# Altium project camera_board.PrjPcb
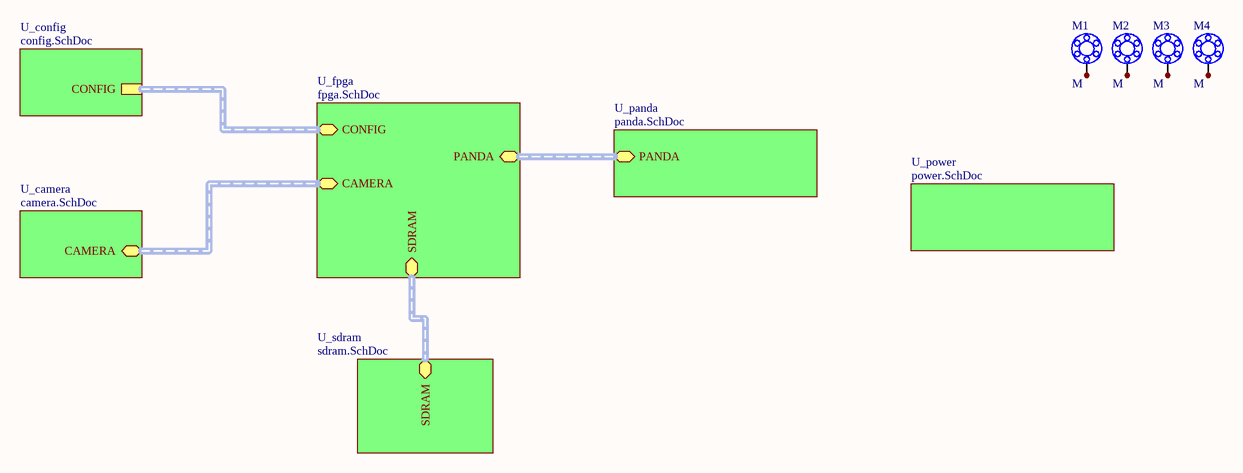
[diagram p0: main.SchDoc]
7 sheets, 119 parts. Net scope: hierarchical (ports join the sheet entries above them; power ports are global).
Board file: camera_board.PcbDoc
Sheets:
  main.SchDoc
    U_fpga = fpga.SchDoc
    U_power = power.SchDoc
    U_config = config.SchDoc
    U_panda = panda.SchDoc
    U_camera = camera.SchDoc
    U_sdram = sdram.SchDoc

## Sheet main.SchDoc
size A4

### Parts
M1  M  [MOUNTING]  (no BOM)
M2  M  [MOUNTING]  (no BOM)
M3  M  [MOUNTING]  (no BOM)
M4  M  [MOUNTING]  (no BOM)

### Sub-sheets
U_camera = camera.SchDoc: CAMERA (harness CAMERA)
U_config = config.SchDoc: CONFIG (harness CONFIG)
U_fpga = fpga.SchDoc: CONFIG (harness CONFIG), CAMERA (harness CAMERA), SDRAM (harness SDRAM), PANDA (harness PANDA)
U_panda = panda.SchDoc: PANDA (harness PANDA)
U_power = power.SchDoc: no entries
U_sdram = sdram.SchDoc: SDRAM (harness SDRAM)

### Nets
NetM1_1: M1.1 M1.2 M1.3 M1.4 M1.5 M1.6 M1.7
NetM2_1: M2.1 M2.2 M2.3 M2.4 M2.5 M2.6 M2.7
NetM3_1: M3.1 M3.2 M3.3 M3.4 M3.5 M3.6 M3.7
NetM4_1: M4.1 M4.2 M4.3 M4.4 M4.5 M4.6 M4.7

### Buses and harness runs
harness sheet U_camera/CAMERA = sheet U_fpga/CAMERA
harness sheet U_config/CONFIG = sheet U_fpga/CONFIG
harness sheet U_fpga/PANDA = sheet U_panda/PANDA
harness sheet U_fpga/SDRAM = sheet U_sdram/SDRAM

### Library data of the parts
M1-M4 = MOUNTING: MOUNTING HOLE - NON INSTALLABLE

## Sheet fpga.SchDoc
size A2
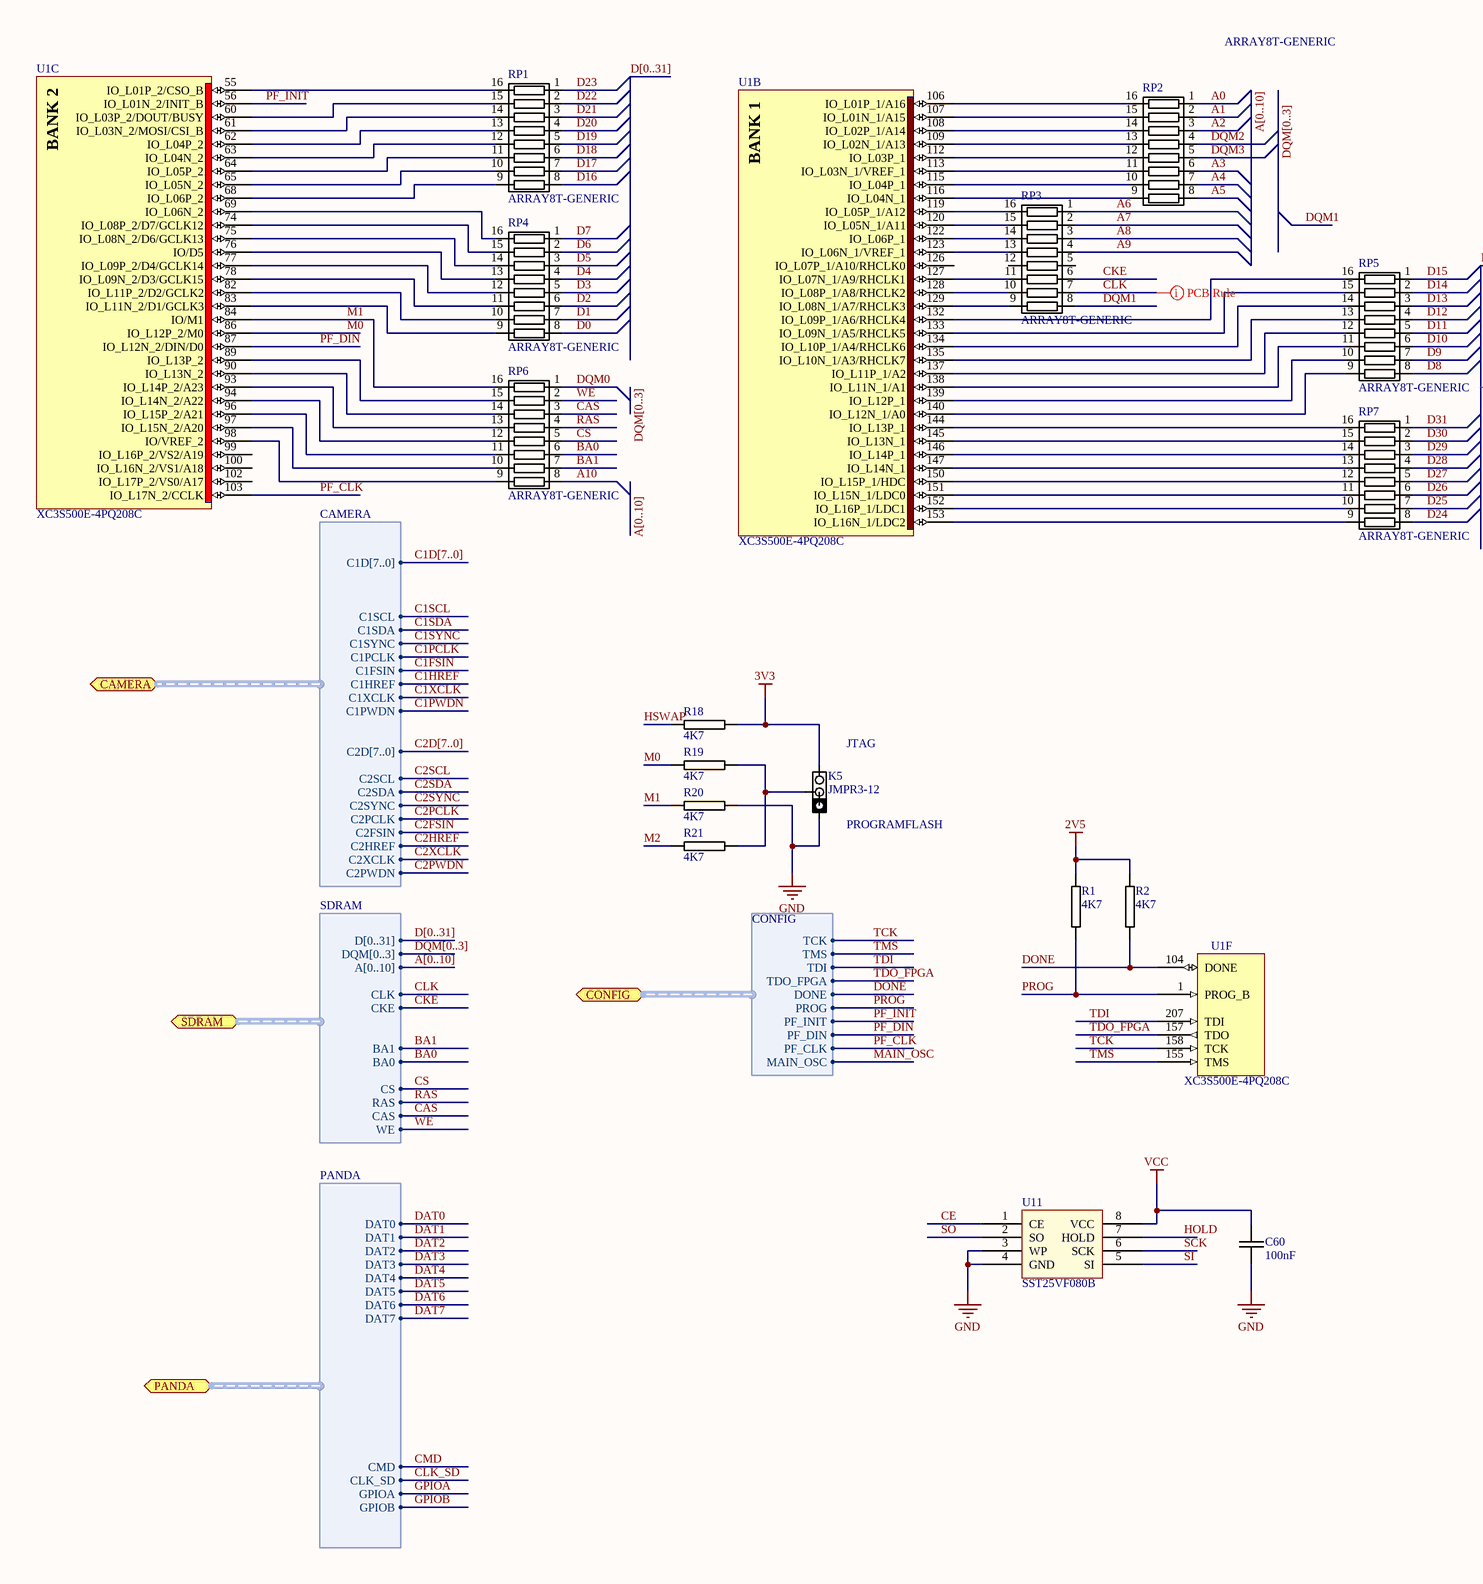
[diagram p1: fpga.SchDoc, left]
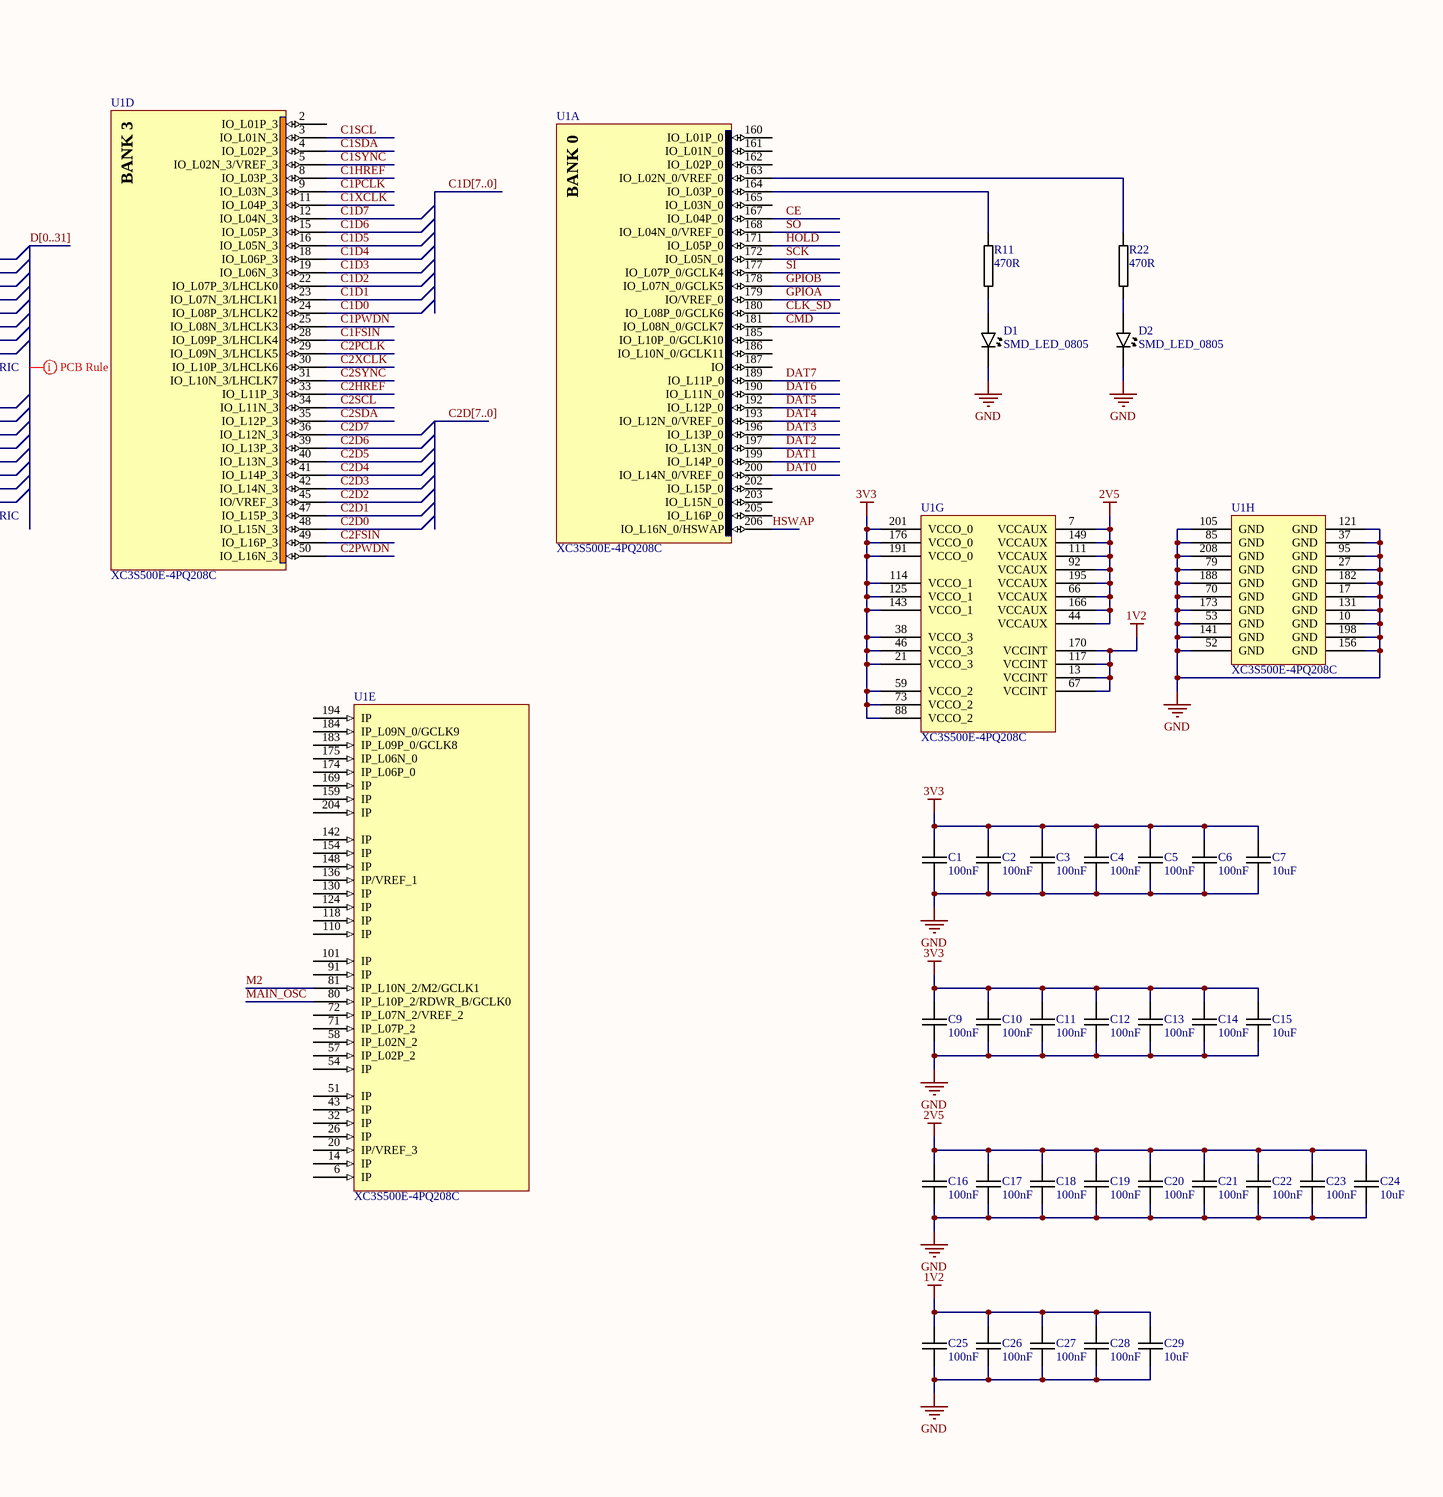
[diagram p2: fpga.SchDoc, right]

### Parts
C1  100nF  [0603C-GENERIC]
C2  100nF  [0603C-GENERIC]
C3  100nF  [0603C-GENERIC]
C4  100nF  [0603C-GENERIC]
C5  100nF  [0603C-GENERIC]
C6  100nF  [0603C-GENERIC]
C7  10uF  [0805C-GENERIC]
C9  100nF  [0603C-GENERIC]
C10  100nF  [0603C-GENERIC]
C11  100nF  [0603C-GENERIC]
C12  100nF  [0603C-GENERIC]
C13  100nF  [0603C-GENERIC]
C14  100nF  [0603C-GENERIC]
C15  10uF  [0805C-GENERIC]
C16  100nF  [0603C-GENERIC]
C17  100nF  [0603C-GENERIC]
C18  100nF  [0603C-GENERIC]
C19  100nF  [0603C-GENERIC]
C20  100nF  [0603C-GENERIC]
C21  100nF  [0603C-GENERIC]
C22  100nF  [0603C-GENERIC]
C23  100nF  [0603C-GENERIC]
C24  10uF  [0805C-GENERIC]
C25  100nF  [0603C-GENERIC]
C26  100nF  [0603C-GENERIC]
C27  100nF  [0603C-GENERIC]
C28  100nF  [0603C-GENERIC]
C29  10uF  [0805C-GENERIC]
C60  100nF  [0603C-GENERIC]
D1  SMD_LED_0805  [CD2012-0805]
D2  SMD_LED_0805  [CD2012-0805]
K5  JMPR3-12  [JMPR3-CLOSED-12]
R1  4K7  [0603R-4K7]
R2  4K7  [0603R-4K7]
R11  470R  [0603R-470]
R18  4K7  [0603R-4K7]
R19  4K7  [0603R-4K7]
R20  4K7  [0603R-4K7]
R21  4K7  [0603R-4K7]
R22  470R  [0603R-470]
RP1  ARRAY8T-GENERIC  [1206-ARRAY-8-GENERIC]
RP2  ARRAY8T-GENERIC  [1206-ARRAY-8-GENERIC]
RP3  ARRAY8T-GENERIC  [1206-ARRAY-8-GENERIC]
RP4  ARRAY8T-GENERIC  [1206-ARRAY-8-GENERIC]
RP5  ARRAY8T-GENERIC  [1206-ARRAY-8-GENERIC]
RP6  ARRAY8T-GENERIC  [1206-ARRAY-8-GENERIC]
RP7  ARRAY8T-GENERIC  [1206-ARRAY-8-GENERIC]
U1  XC3S500E-4PQ208C  [PQ208_N]  (parts A,B,C,D,E,F,G,H of 8)
U11  SST25VF080B  [SOIC127P600-8BM]

### Ports
CAMERA (harness CAMERA), CONFIG (harness CONFIG), PANDA (harness PANDA), SDRAM (harness SDRAM)

### Harnesses
CONFIG: TCK, TMS, TDI, TDO_FPGA, DONE, PROG, PF_DIN, PF_INIT, PF_CLK, MAIN_OSC
CAMERA: C1D[7..0], C1SCL, C1SDA, C1SYNC, C1PCLK, C1FSIN, C1HREF, C1XCLK, C1PWDN, C2D[7..0], C2SCL, C2SDA, C2SYNC, C2PCLK, C2HREF, C2FSIN, C2XCLK, C2PWDN
SDRAM: D[0..31], DQM[0..3], A[0..10], CLK, CKE, BA1, BA0, CS, RAS, CAS, WE
PANDA: DAT0, DAT1, DAT2, DAT3, DAT4, DAT5, DAT6, DAT7, CMD, CLK_SD, GPIOA, GPIOB

### Nets
1V2: C25.1 C26.1 C27.1 C28.1 C29.1 U1.13(VCCINT) U1.67(VCCINT) U1.117(VCCINT) U1.170(VCCINT)
2V5: C16.1 C17.1 C18.1 C19.1 C20.1 C21.1 C22.1 C23.1 C24.1 R1.1 R2.1 U1.7(VCCAUX) U1.44(VCCAUX) U1.66(VCCAUX) U1.92(VCCAUX) U1.111(VCCAUX) U1.149(VCCAUX) U1.166(VCCAUX) U1.195(VCCAUX)
3V3: C1.1 C2.1 C3.1 C4.1 C5.1 C6.1 C7.1 C9.1 C10.1 C11.1 C12.1 C13.1 C14.1 C15.1 K5.3 R18.2 U1.21(VCCO_3) U1.38(VCCO_3) U1.46(VCCO_3) U1.59(VCCO_2) U1.73(VCCO_2) U1.88(VCCO_2) U1.114(VCCO_1) U1.125(VCCO_1) U1.143(VCCO_1) U1.176(VCCO_0) U1.191(VCCO_0) U1.201(VCCO_0)
GND: C1.2 C2.2 C3.2 C4.2 C5.2 C6.2 C7.2 C9.2 C10.2 C11.2 C12.2 C13.2 C14.2 C15.2 C16.2 C17.2 C18.2 C19.2 C20.2 C21.2 C22.2 C23.2 C24.2 C25.2 C26.2 C27.2 C28.2 C29.2 C60.2 D1.2(K) D2.2(K) K5.1 R20.2 U1.10(GND) U1.17(GND) U1.27(GND) U1.37(GND) U1.52(GND) U1.53(GND) U1.70(GND) U1.79(GND) U1.85(GND) U1.95(GND) U1.105(GND) U1.121(GND) U1.131(GND) U1.141(GND) U1.156(GND) U1.173(GND) U1.182(GND) U1.188(GND) U1.198(GND) U1.208(GND) U11.3(WP) U11.4(GND)
VCC: C60.1 U11.8(VCC)
A0: RP2.1
A1: RP2.2
A2: RP2.3
A3: RP2.6
A4: RP2.7
A5: RP2.8
A6: RP3.1
A7: RP3.2
A8: RP3.3
A9: RP3.4
A10: RP6.8
BA0: RP6.6 ; port SDRAM.BA0
BA1: RP6.7 ; port SDRAM.BA1
C1D0: U1.24(IO_L08P_3/LHCLK2)
C1D1: U1.23(IO_L07N_3/LHCLK1)
C1D2: U1.22(IO_L07P_3/LHCLK0)
C1D3: U1.19(IO_L06N_3)
C1D4: U1.18(IO_L06P_3)
C1D5: U1.16(IO_L05N_3)
C1D6: U1.15(IO_L05P_3)
C1D7: U1.12(IO_L04N_3)
C1FSIN: U1.28(IO_L09P_3/LHCLK4) ; port CAMERA.C1FSIN
C1HREF: U1.8(IO_L03P_3) ; port CAMERA.C1HREF
C1PCLK: U1.9(IO_L03N_3) ; port CAMERA.C1PCLK
C1PWDN: U1.25(IO_L08N_3/LHCLK3) ; port CAMERA.C1PWDN
C1SCL: U1.3(IO_L01N_3) ; port CAMERA.C1SCL
C1SDA: U1.4(IO_L02P_3) ; port CAMERA.C1SDA
C1SYNC: U1.5(IO_L02N_3/VREF_3) ; port CAMERA.C1SYNC
C1XCLK: U1.11(IO_L04P_3) ; port CAMERA.C1XCLK
C2D0: U1.48(IO_L15N_3)
C2D1: U1.47(IO_L15P_3)
C2D2: U1.45(IO/VREF_3)
C2D3: U1.42(IO_L14N_3)
C2D4: U1.41(IO_L14P_3)
C2D5: U1.40(IO_L13N_3)
C2D6: U1.39(IO_L13P_3)
C2D7: U1.36(IO_L12N_3)
C2FSIN: U1.49(IO_L16P_3) ; port CAMERA.C2FSIN
C2HREF: U1.33(IO_L11P_3) ; port CAMERA.C2HREF
C2PCLK: U1.29(IO_L09N_3/LHCLK5) ; port CAMERA.C2PCLK
C2PWDN: U1.50(IO_L16N_3) ; port CAMERA.C2PWDN
C2SCL: U1.34(IO_L11N_3) ; port CAMERA.C2SCL
C2SDA: U1.35(IO_L12P_3) ; port CAMERA.C2SDA
C2SYNC: U1.31(IO_L10N_3/LHCLK7) ; port CAMERA.C2SYNC
C2XCLK: U1.30(IO_L10P_3/LHCLK6) ; port CAMERA.C2XCLK
CAS: RP6.3 ; port SDRAM.CAS
CE: U1.167(IO_L04P_0) U11.1(CE)
CKE: RP3.6 ; port SDRAM.CKE
CLK: RP3.7 ; port SDRAM.CLK
CLK_SD: U1.180(IO_L08P_0/GCLK6) ; port PANDA.CLK_SD
CMD: U1.181(IO_L08N_0/GCLK7) ; port PANDA.CMD
CS: RP6.5 ; port SDRAM.CS
D0: RP4.8
D1: RP4.7
D2: RP4.6
D3: RP4.5
D4: RP4.4
D5: RP4.3
D6: RP4.2
D7: RP4.1
D8: RP5.8
D9: RP5.7
D10: RP5.6
D11: RP5.5
D12: RP5.4
D13: RP5.3
D14: RP5.2
D15: RP5.1
D16: RP1.8
D17: RP1.7
D18: RP1.6
D19: RP1.5
D20: RP1.4
D21: RP1.3
D22: RP1.2
D23: RP1.1
D24: RP7.8
D25: RP7.7
D26: RP7.6
D27: RP7.5
D28: RP7.4
D29: RP7.3
D30: RP7.2
D31: RP7.1
DAT0: U1.200(IO_L14N_0/VREF_0) ; port PANDA.DAT0
DAT1: U1.199(IO_L14P_0) ; port PANDA.DAT1
DAT2: U1.197(IO_L13N_0) ; port PANDA.DAT2
DAT3: U1.196(IO_L13P_0) ; port PANDA.DAT3
DAT4: U1.193(IO_L12N_0/VREF_0) ; port PANDA.DAT4
DAT5: U1.192(IO_L12P_0) ; port PANDA.DAT5
DAT6: U1.190(IO_L11N_0) ; port PANDA.DAT6
DAT7: U1.189(IO_L11P_0) ; port PANDA.DAT7
DONE: R2.2 U1.104(DONE) ; port CONFIG.DONE
DQM0: RP6.1
DQM1: RP3.8
DQM2: RP2.4
DQM3: RP2.5
GPIOA: U1.179(IO/VREF_0) ; port PANDA.GPIOA
GPIOB: U1.178(IO_L07N_0/GCLK5) ; port PANDA.GPIOB
HOLD: U1.171(IO_L05P_0) U11.7(HOLD)
HSWAP: R18.1 U1.206(IO_L16N_0/HSWAP)
M0: R19.1 U1.86(IO_L12P_2/M0)
M1: R20.1 RP6.16 U1.84(IO/M1)
M2: R21.1 U1.81(IP_L10N_2/M2/GCLK1)
MAIN_OSC: U1.80(IP_L10P_2/RDWR_B/GCLK0) ; port CONFIG.MAIN_OSC
PF_CLK: U1.103(IO_L17N_2/CCLK) ; port CONFIG.PF_CLK
PF_DIN: U1.87(IO_L12N_2/DIN/D0) ; port CONFIG.PF_DIN
PF_INIT: U1.56(IO_L01N_2/INIT_B) ; port CONFIG.PF_INIT
PROG: R1.2 U1.1(PROG_B) ; port CONFIG.PROG
RAS: RP6.4 ; port SDRAM.RAS
SCK: U1.172(IO_L05N_0) U11.6(SCK)
SI: U1.177(IO_L07P_0/GCLK4) U11.5(SI)
SO: U1.168(IO_L04N_0/VREF_0) U11.2(SO)
TCK: U1.158(TCK) ; port CONFIG.TCK
TDI: U1.207(TDI) ; port CONFIG.TDI
TDO_FPGA: U1.157(TDO) ; port CONFIG.TDO_FPGA
TMS: U1.155(TMS) ; port CONFIG.TMS
WE: RP6.2 ; port SDRAM.WE
NetD1_1: D1.1(A) R11.2
NetD2_1: D2.1(A) R22.2
NetK5_2: K5.2 R19.2 R21.2
NetR11_1: R11.1 U1.164(IO_L03P_0)
NetR22_1: R22.1 U1.163(IO_L02N_0/VREF_0)
NetRP1_9: RP1.9 U1.68(IO_L06P_2)
NetRP1_10: RP1.10 U1.65(IO_L05N_2)
NetRP1_11: RP1.11 U1.64(IO_L05P_2)
NetRP1_12: RP1.12 U1.63(IO_L04N_2)
NetRP1_13: RP1.13 U1.62(IO_L04P_2)
NetRP1_14: RP1.14 U1.61(IO_L03N_2/MOSI/CSI_B)
NetRP1_15: RP1.15 U1.60(IO_L03P_2/DOUT/BUSY)
NetRP1_16: RP1.16 U1.55(IO_L01P_2/CSO_B)
NetRP2_9: RP2.9 U1.116(IO_L04N_1)
NetRP2_10: RP2.10 U1.115(IO_L04P_1)
NetRP2_11: RP2.11 U1.113(IO_L03N_1/VREF_1)
NetRP2_12: RP2.12 U1.112(IO_L03P_1)
NetRP2_13: RP2.13 U1.109(IO_L02N_1/A13)
NetRP2_14: RP2.14 U1.108(IO_L02P_1/A14)
NetRP2_15: RP2.15 U1.107(IO_L01N_1/A15)
NetRP2_16: RP2.16 U1.106(IO_L01P_1/A16)
NetRP3_9: RP3.9 U1.129(IO_L08N_1/A7/RHCLK3)
NetRP3_10: RP3.10 U1.128(IO_L08P_1/A8/RHCLK2)
NetRP3_11: RP3.11 U1.127(IO_L07N_1/A9/RHCLK1)
NetRP3_13: RP3.13 U1.123(IO_L06N_1/VREF_1)
NetRP3_14: RP3.14 U1.122(IO_L06P_1)
NetRP3_15: RP3.15 U1.120(IO_L05N_1/A11)
NetRP3_16: RP3.16 U1.119(IO_L05P_1/A12)
NetRP4_9: RP4.9 U1.83(IO_L11N_2/D1/GCLK3)
NetRP4_10: RP4.10 U1.82(IO_L11P_2/D2/GCLK2)
NetRP4_11: RP4.11 U1.78(IO_L09N_2/D3/GCLK15)
NetRP4_12: RP4.12 U1.77(IO_L09P_2/D4/GCLK14)
NetRP4_13: RP4.13 U1.76(IO/D5)
NetRP4_14: RP4.14 U1.75(IO_L08N_2/D6/GCLK13)
NetRP4_15: RP4.15 U1.74(IO_L08P_2/D7/GCLK12)
NetRP4_16: RP4.16 U1.69(IO_L06N_2)
NetRP5_9: RP5.9 U1.140(IO_L12N_1/A0)
NetRP5_10: RP5.10 U1.139(IO_L12P_1)
NetRP5_11: RP5.11 U1.138(IO_L11N_1/A1)
NetRP5_12: RP5.12 U1.137(IO_L11P_1/A2)
NetRP5_13: RP5.13 U1.135(IO_L10N_1/A3/RHCLK7)
NetRP5_14: RP5.14 U1.134(IO_L10P_1/A4/RHCLK6)
NetRP5_15: RP5.15 U1.133(IO_L09N_1/A5/RHCLK5)
NetRP5_16: RP5.16 U1.132(IO_L09P_1/A6/RHCLK4)
NetRP6_9: RP6.9 U1.98(IO/VREF_2)
NetRP6_10: RP6.10 U1.97(IO_L15N_2/A20)
NetRP6_11: RP6.11 U1.96(IO_L15P_2/A21)
NetRP6_12: RP6.12 U1.94(IO_L14N_2/A22)
NetRP6_13: RP6.13 U1.93(IO_L14P_2/A23)
NetRP6_14: RP6.14 U1.90(IO_L13N_2)
NetRP6_15: RP6.15 U1.89(IO_L13P_2)
NetRP7_9: RP7.9 U1.153(IO_L16N_1/LDC2)
NetRP7_10: RP7.10 U1.152(IO_L16P_1/LDC1)
NetRP7_11: RP7.11 U1.151(IO_L15N_1/LDC0)
NetRP7_12: RP7.12 U1.150(IO_L15P_1/HDC)
NetRP7_13: RP7.13 U1.147(IO_L14N_1)
NetRP7_14: RP7.14 U1.146(IO_L14P_1)
NetRP7_15: RP7.15 U1.145(IO_L13N_1)
NetRP7_16: RP7.16 U1.144(IO_L13P_1)

Not connected (* = marked no-connect by the designer): RP3 5 12; U1 2(IO_L01P_3) 6(IP) 14(IP) 20(IP/VREF_3) 26(IP) 32(IP) 43(IP) 51(IP) 54(IP) 57(IP_L02P_2) 58(IP_L02N_2) 71(IP_L07P_2) 72(IP_L07N_2/VREF_2) 91(IP) 99(IO_L16P_2/VS2/A19) 100(IO_L16N_2/VS1/A18) 101(IP) 102(IO_L17P_2/VS0/A17) 110(IP) 118(IP) 124(IP) 126(IO_L07P_1/A10/RHCLK0) 130(IP) 136(IP/VREF_1) 142(IP) 148(IP) 154(IP) 159(IP) 160(IO_L01P_0) 161(IO_L01N_0) 162(IO_L02P_0) 165(IO_L03N_0) 169(IP) 174(IP_L06P_0) 175(IP_L06N_0) 183(IP_L09P_0/GCLK8) 184(IP_L09N_0/GCLK9) 185(IO_L10P_0/GCLK10) 186(IO_L10N_0/GCLK11) 187(IO) 194(IP) 202(IO_L15P_0) 203(IO_L15N_0) 204(IP) 205(IO_L16P_0)

### Buses and harness runs
bus A[0..10]
bus C1D[7..0]
bus C2D[7..0]
bus D[0..31]
bus DQM[0..3]

### Layout directives
rule Matched Net Lengths [Tolerance = 500mil]: (no net found under the mark)
rule Length Constraint [Min Length = 35mm    Max Length = 50mm]: CLK

### Notes on the sheet
- (near K5) JTAG
- (near K5) PROGRAMFLASH
- (in symbol XC3S500E-4PQ208C, part A) BANK 0
- (in symbol XC3S500E-4PQ208C, part B) BANK 1
- (in symbol XC3S500E-4PQ208C, part C) BANK 2
- (in symbol XC3S500E-4PQ208C, part D) BANK 3

### Library data of the parts
C1-C6 C9-C14 C16-C23 C25-C28 C60 = 0603C-100NF-50V-X7R-TDK: GENERIC CAPACITOR NON POLARISED 0603; Manufacturer Part Number: C1608X7R1H103K; Manufacturer: TDK Corporation; Temperature Coefficient: X7R; Tolerance: ±10%; Voltage - Rated: 50V; Capacitance: 10000pF; Description: CAP CER 10000PF 50V X7R 10% 0603; Reel: C68; RoHS: RoHS Compliant; Lead Spacing: -; Package / Case: 0603 (1608 metric); Features: General Purpose; Packaging: Tape & Reel (TR); Thickness: 0.80mm; Operating Temperature: -55°C ~ 125°C; Mounting Type: Surface Mount, MLCC; Category: Capacitors; Supplier 1: Digi-Key; Supplier Part Number 1: 445-1314-2-ND
C7 C15 C24 C29 = 0805C-10UF-16V-X5R-TDK: CAPACITOR 0805 CERAMIC; Manufacturer Part Number: C2012X5R1C106M; Manufacturer: TDK Corporation; REEL: C63; Description: CAP CER 10UF 16V X5R 0805; Supplier 1: Digi-Key; Supplier Part Number 1: 445-4115-2-ND
K5 = JMPR3-12: JMPR3; Manufacturer: Sullins Connector Solutions; Manufacturer Part Number: PBC36SAAN; Description: CONN HEADER .100 SINGL STR 36POS; Reel: Closed 1-2; Supplier 1: Digi-Key; Supplier Part Number 1: S1011E-36-ND
R1 R2 R18-R21 = 0603R-4K7: GENERIC RESISTOR 0603; Manufacturer: Stackpole Electronics Inc; Manufacturer Part Number: RMCF 1/16 4.7K 1% R; Description: RES 4.7K OHM 1/10W 1% 0603 SMD; Reel: R23; Supplier 1: Digi-Key; Supplier Part Number 1: RMCF1/164.7KFRTR-ND
R11 R22 = 0603R-470: GENERIC RESISTOR 0603; Manufacturer Part Number: RMCF 1/16 470 1% R; Manufacturer: Stackpole Electronics Inc; Tolerance: ±1%; Power (Watts): 0.1W, 1/10W; Temperature Coefficient: ±100ppm/°C; Resistance In Ohms: 470; Description: RES 470 OHM 1/10W 1% 0603 SMD; Reel: R17; Supplier 1: Digi-Key; Supplier Part Number 1: RMCF1/16470FRTR-ND; Supplier: Digi-Key; Composition: Thick Film; Packaging: Tape & Reel (TR); Lead Style: Surface Mount (SMD - SMT); Category: Resistors; RoHS: RoHS Compliant; Supplier Part Number: RMCF1/16470FRTR-ND; Case: 0603 (1608 metric)
RP1-RP7 = ARRAY8T-GENERIC: GENERIC RESISTOR ARRAY 8X INDEPENDENT
U1 = XC3S500E-4PQ208C: Spartan-3E 1.2V FPGA, 158 User I/Os, 208-Pin PQFP, Standard Performance, Commercial Grade; Published: 6-Jun-2005; LatestRevisionDate: 30-Oct-2009; LatestRevisionNote: Updated to datasheet version 3.8 Aug-2009.; DatasheetVersion: ver3.8, Aug-2009; PackageVersion: ver1.2, Jun-2004; PackageReference: PQ208; Publisher: Altium Limited; PackageDescription: 208-Pin Plastic Quad Flat Pack (PQ208); Code_JEDEC: MS-029-FA-1; ComponentLink1Description: Spartan-3E Datasheet; ComponentLink1URL: http://www.xilinx.com/support/documentation/data_sheets/ds312.pdf; ComponentLink2Description: PQ208 Package Drawing; ComponentLink2URL: http://www.xilinx.com/support/documentation/package_specs/pq208.pdf; ComponentLink3Description: Spartan-3E Documents; ComponentLink3URL: http://www.xilinx.com/support/documentation/spartan-3e.htm; ComponentLink4Description: Xilinx.com Home; ComponentLink4URL: http://www.xilinx.com

## Sheet power.SchDoc
size A4
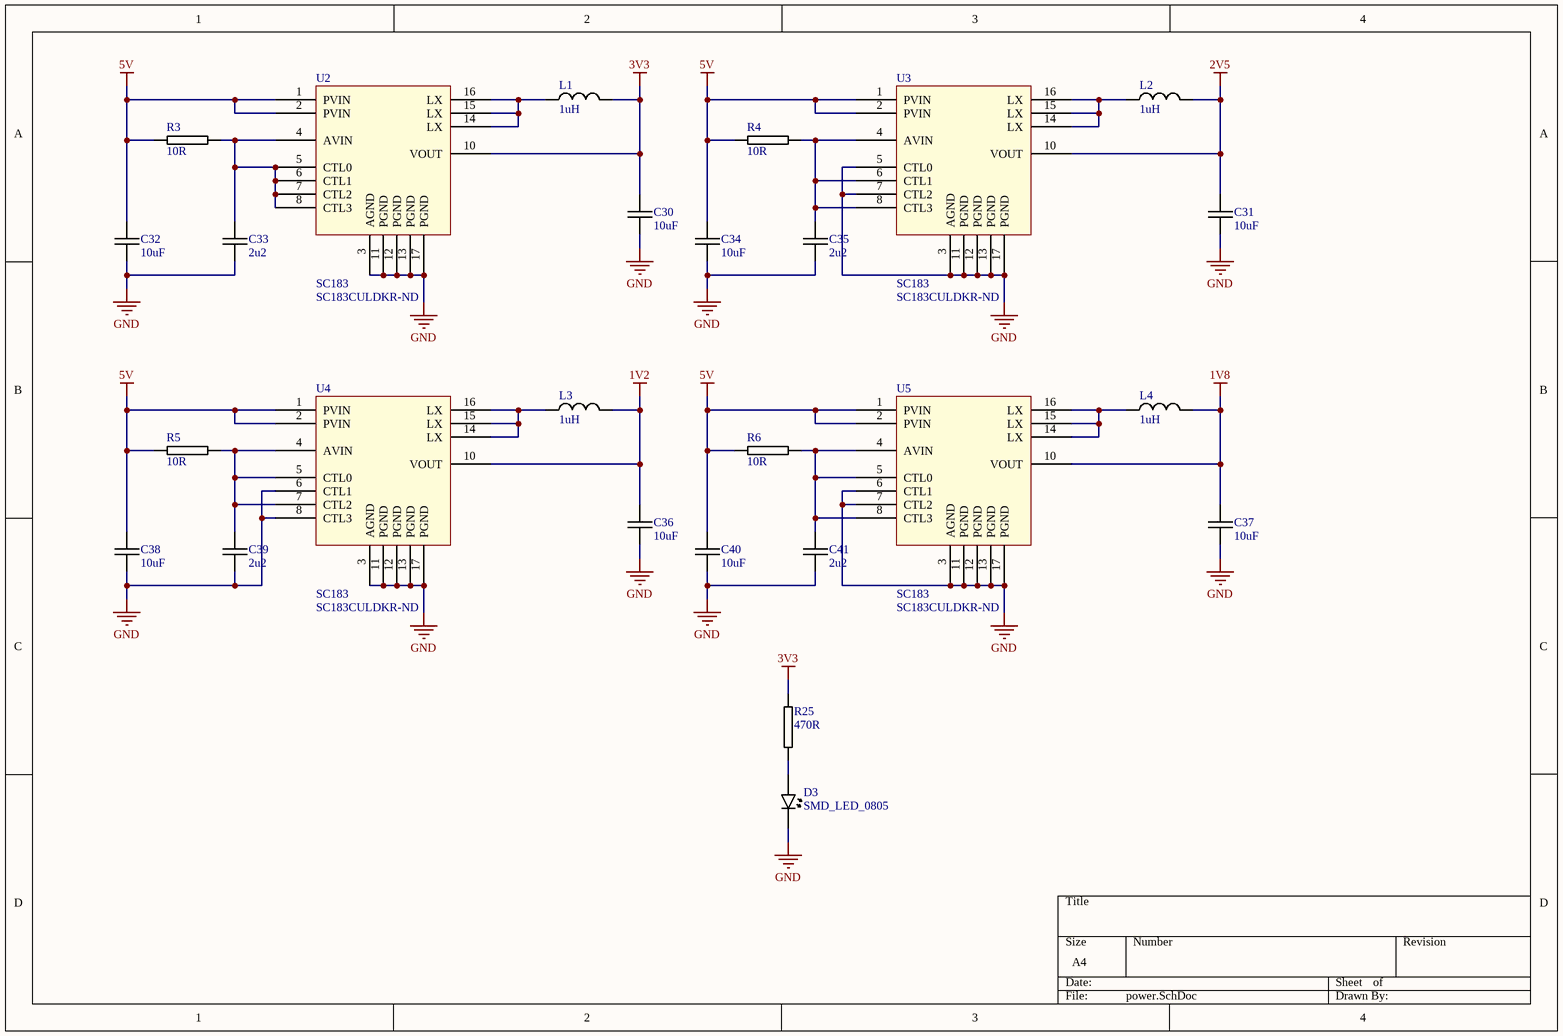
[diagram p3: power.SchDoc]

### Parts
C30  10uF  [0805C-GENERIC]
C31  10uF  [0805C-GENERIC]
C32  10uF  [0805C-GENERIC]
C33  2u2  [0805C-GENERIC]
C34  10uF  [0805C-GENERIC]
C35  2u2  [0805C-GENERIC]
C36  10uF  [0805C-GENERIC]
C37  10uF  [0805C-GENERIC]
C38  10uF  [0805C-GENERIC]
C39  2u2  [0805C-GENERIC]
C40  10uF  [0805C-GENERIC]
C41  2u2  [0805C-GENERIC]
D3  SMD_LED_0805  [CD2012-0805]
L1  1uH  [VISHAY-IHLP1616-GENERIC]
L2  1uH  [VISHAY-IHLP1616-GENERIC]
L3  1uH  [VISHAY-IHLP1616-GENERIC]
L4  1uH  [VISHAY-IHLP1616-GENERIC]
R3  10R  [0603R-10]
R4  10R  [0603R-10]
R5  10R  [0603R-10]
R6  10R  [0603R-10]
R25  470R  [0603R-470]
U2  SC183  Supplier Part Number 1: SC183CULDKR-ND  [QFN50P300X300-16V6N]
U3  SC183  Supplier Part Number 1: SC183CULDKR-ND  [QFN50P300X300-16V6N]
U4  SC183  Supplier Part Number 1: SC183CULDKR-ND  [QFN50P300X300-16V6N]
U5  SC183  Supplier Part Number 1: SC183CULDKR-ND  [QFN50P300X300-16V6N]

### Nets
1V2: C36.1 L3.2 U4.10(VOUT)
1V8: C37.1 L4.2 U5.10(VOUT)
2V5: C31.1 L2.2 U3.10(VOUT)
3V3: C30.1 L1.2 R25.1 U2.10(VOUT)
5V: C32.1 C34.1 C38.1 C40.1 R3.1 R4.1 R5.1 R6.1 U2.1(PVIN) U2.2(PVIN) U3.1(PVIN) U3.2(PVIN) U4.1(PVIN) U4.2(PVIN) U5.1(PVIN) U5.2(PVIN)
GND: C30.2 C31.2 C32.2 C33.2 C34.2 C35.2 C36.2 C37.2 C38.2 C39.2 C40.2 C41.2 D3.2(K) U2.3(AGND) U2.11(PGND) U2.12(PGND) U2.13(PGND) U2.17(PGND) U3.3(AGND) U3.5(CTL0) U3.7(CTL2) U3.11(PGND) U3.12(PGND) U3.13(PGND) U3.17(PGND) U4.3(AGND) U4.6(CTL1) U4.8(CTL3) U4.11(PGND) U4.12(PGND) U4.13(PGND) U4.17(PGND) U5.3(AGND) U5.6(CTL1) U5.7(CTL2) U5.11(PGND) U5.12(PGND) U5.13(PGND) U5.17(PGND)
NetC33_1: C33.1 R3.2 U2.4(AVIN) U2.5(CTL0) U2.6(CTL1) U2.7(CTL2) U2.8(CTL3)
NetC35_1: C35.1 R4.2 U3.4(AVIN) U3.6(CTL1) U3.8(CTL3)
NetC39_1: C39.1 R5.2 U4.4(AVIN) U4.5(CTL0) U4.7(CTL2)
NetC41_1: C41.1 R6.2 U5.4(AVIN) U5.5(CTL0) U5.8(CTL3)
NetD3_1: D3.1(A) R25.2
NetL1_1: L1.1 U2.14(LX) U2.15(LX) U2.16(LX)
NetL2_1: L2.1 U3.14(LX) U3.15(LX) U3.16(LX)
NetL3_1: L3.1 U4.14(LX) U4.15(LX) U4.16(LX)
NetL4_1: L4.1 U5.14(LX) U5.15(LX) U5.16(LX)

### Library data of the parts
C30-C32 C34 C36-C38 C40 = 0805C-10UF-16V-X5R-TDK: as C7 on sheet fpga; Supplier 1: Digi-Key; Supplier Part Number 1: 445-4115-2-ND
C33 C35 C39 C41 = 0805C-2U2-6V3-X5R-PAN: CAPACITOR 0805 CERAMIC; Manufacturer Part Number: ECJ-1VB0J225K; Manufacturer: Panasonic - ECG; Description: CAP 2.2UF 6.3V CERAMIC X5R 0603; Reel: C7; Supplier 1: Digi-Key; Supplier Part Number 1: PCC2273TR-ND
L1-L4 = 1U-IHLP1616-VISHAY: Manufacturer Part Number: IHLP1616ABER1R0M01; Manufacturer: Vishay/Dale; Reel: L8; Description: INDUCTOR POWER 1.0UH 4.0A SMD; Supplier 1: Digi-Key; Supplier Part Number 1: 541-1043-2-ND
R3-R6 = 0603R-10R: GENERIC RESISTOR 0603; Manufacturer Part Number: RMCF 1/16 10 1% R; Manufacturer: Stackpole Electronics Inc; Description: RES 10 OHM 1/10W 1% 0603 SMD; Resistance In Ohms: 10.0; Tolerance: ±1%; Temperature Coefficient: ±100ppm/°C; Power (Watts): 0.1W, 1/10W; Reel: *; Supplier: Digi-Key; Supplier Part Number: RMCF1/1610FRDKR-ND; Composition: Thick Film; RoHS: RoHS Compliant; Category: Resistors; Lead Style: Surface Mount (SMD - SMT); Packaging: Digi-Reel®; Case: 0603 (1608 metric); Supplier 1: Digi-Key; Supplier Part Number 1: RMCF1/1610FRDKR-ND
R25 = 0603R-470: as R11 on sheet fpga; Supplier 1: Digi-Key; Supplier Part Number 1: RMCF1/16470FRTR-ND; Supplier: Digi-Key; Composition: Thick Film; Packaging: Tape & Reel (TR); Lead Style: Surface Mount (SMD - SMT); Category: Resistors; RoHS: RoHS Compliant; Supplier Part Number: RMCF1/16470FRTR-ND; Case: 0603 (1608 metric)
U2-U5 = SC183: Supplier 1: Digi-Key

## Sheet config.SchDoc
size A4
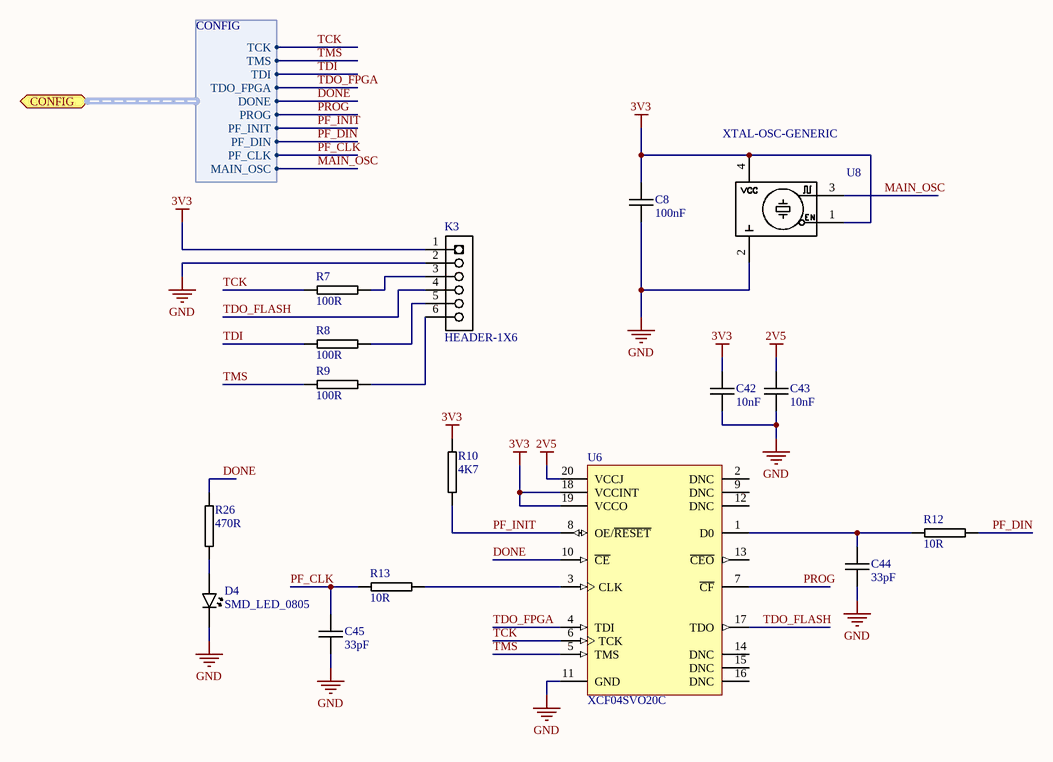
[diagram p4: config.SchDoc]

### Parts
C8  100nF  [0603C-GENERIC]
C42  10nF  [0603C-GENERIC]
C43  10nF  [0603C-GENERIC]
C44  33pF  [0603C-GENERIC]
C45  33pF  [0603C-GENERIC]
D4  SMD_LED_0805  [CD2012-0805]
K3  HEADER-1X6  [HEADER-1X6]
R7  100R  [0603R-100]
R8  100R  [0603R-100]
R9  100R  [0603R-100]
R10  4K7  [0603R-4K7]
R12  10R  [0603R-10]
R13  10R  [0603R-10]
R26  470R  [0603R-470]
U6  XCF04SVO20C  [VO20_N]
U8  XTAL-OSC-GENERIC  [XOSC-5X7]

### Ports
CONFIG (harness CONFIG)

### Harnesses
CONFIG: TCK, TMS, TDI, TDO_FPGA, DONE, PROG, PF_DIN, PF_INIT, PF_CLK, MAIN_OSC

### Nets
2V5: C43.1 U6.20(VCCJ)
3V3: C8.1 C42.1 K3.1 R10.1 U6.18(VCCINT) U6.19(VCCO) U8.1(EN) U8.4(VCC)
GND: C8.2 C42.2 C43.2 C44.2 C45.2 D4.2(K) K3.2 U6.11(GND) U8.2(GND)
DONE: R26.1 U6.10(~{CE}) ; port CONFIG.DONE
MAIN_OSC: U8.3(OUT) ; port CONFIG.MAIN_OSC
PF_CLK: C45.1 R13.1 ; port CONFIG.PF_CLK
PF_DIN: R12.2 ; port CONFIG.PF_DIN
PF_INIT: R10.2 U6.8(OE/~{RESET}) ; port CONFIG.PF_INIT
PROG: U6.7(~{CF}) ; port CONFIG.PROG
TCK: R7.1 U6.6(TCK) ; port CONFIG.TCK
TDI: R8.1 ; port CONFIG.TDI
TDO_FLASH: K3.4 U6.17(TDO)
TDO_FPGA: U6.4(TDI) ; port CONFIG.TDO_FPGA
TMS: R9.1 U6.5(TMS) ; port CONFIG.TMS
NetC44_1: C44.1 R12.1 U6.1(D0)
NetD4_1: D4.1(A) R26.2
NetK3_3: K3.3 R7.2
NetK3_5: K3.5 R8.2
NetK3_6: K3.6 R9.2
NetR13_2: R13.2 U6.3(CLK)

Not connected (* = marked no-connect by the designer): U6 2(DNC) 9(DNC) 12(DNC) 13(~{CEO}) 14(DNC) 15(DNC) 16(DNC)

### Library data of the parts
C8 = 0603C-100NF-50V-X7R-TDK: as C1 on sheet fpga; RoHS: RoHS Compliant; Lead Spacing: -; Package / Case: 0603 (1608 metric); Features: General Purpose; Packaging: Tape & Reel (TR); Thickness: 0.80mm; Operating Temperature: -55°C ~ 125°C; Mounting Type: Surface Mount, MLCC; Category: Capacitors; Supplier 1: Digi-Key; Supplier Part Number 1: 445-1314-2-ND
C42 C43 = 0603C-10NF-50V-X7R-MUR: GENERIC CAPACITOR NON POLARISED 0603; Manufacturer Part Number: GRM188R71H103KA01D; Manufacturer: Murata Electronics North America; Reel: C22; Description: CAP CER 10000PF 50V 10% X7R 0603; Supplier 1: Digi-Key; Supplier Part Number 1: 490-1512-2-ND
C44 C45 = 0603C-33PF-50V-C0G-PAN: GENERIC CAPACITOR NON POLARISED 0603; Reel: C42
R7-R9 = 0603R-100: GENERIC RESISTOR 0603; Manufacturer Part Number: RMCF 1/16 100 1% R; Manufacturer: Stackpole Electronics Inc; Description: RES 100 OHM 1/10W 1% 0603 SMD; Reel: R24; Supplier 1: Digi-Key; Supplier Part Number 1: RMCF1/16100FRDKR-ND
R10 = 0603R-4K7: as R1 on sheet fpga; Supplier 1: Digi-Key; Supplier Part Number 1: RMCF1/164.7KFRTR-ND
R12 R13 = 0603R-10R: as R3 on sheet power; Reel: *; Supplier: Digi-Key; Supplier Part Number: RMCF1/1610FRDKR-ND; Composition: Thick Film; RoHS: RoHS Compliant; Category: Resistors; Lead Style: Surface Mount (SMD - SMT); Packaging: Digi-Reel®; Case: 0603 (1608 metric); Supplier 1: Digi-Key; Supplier Part Number 1: RMCF1/1610FRDKR-ND
R26 = 0603R-470: as R11 on sheet fpga; Supplier 1: Digi-Key; Supplier Part Number 1: RMCF1/16470FRTR-ND; Supplier: Digi-Key; Composition: Thick Film; Packaging: Tape & Reel (TR); Lead Style: Surface Mount (SMD - SMT); Category: Resistors; RoHS: RoHS Compliant; Supplier Part Number: RMCF1/16470FRTR-ND; Case: 0603 (1608 metric)
U6 = XCF04SVO20C: XCF00S Series, Platform Flash In-System Programmable Configuration 3.3V PROM, 20-Pin TSOP, 4-Megabit, Commercial Grade; Published: 17-Sep-2003; LatestRevisionDate: 04-Mar-2005; LatestRevisionNote: Stylized 3D Model Added.; DatasheetVersion: ver2.9, May-2006; PackageVersion: ver1.2.1, Apr-2005; PackageReference: VO20; Publisher: Altium Limited; PackageDescription: 20-Pin Thin Shrink Small Outline Package (VO20); Code_JEDEC: MO-153-AC; ComponentLink1Description: Manufacturer Link; ComponentLink1URL: http://www.xilinx.com/products/design_resources/config_sol/index.htm; ComponentLink2Description: Datasheet; ComponentLink2URL: http://direct.xilinx.com/bvdocs/publications/ds123.pdf
U8 = XTAL-OSC-GENERIC: GENERIC CRYSTAL OSCILLATOR
K3 = HEADER-1X6: Supplier 1: Digi-Key; Supplier Part Number 1: S1011E-36-ND

## Sheet panda.SchDoc
size A4
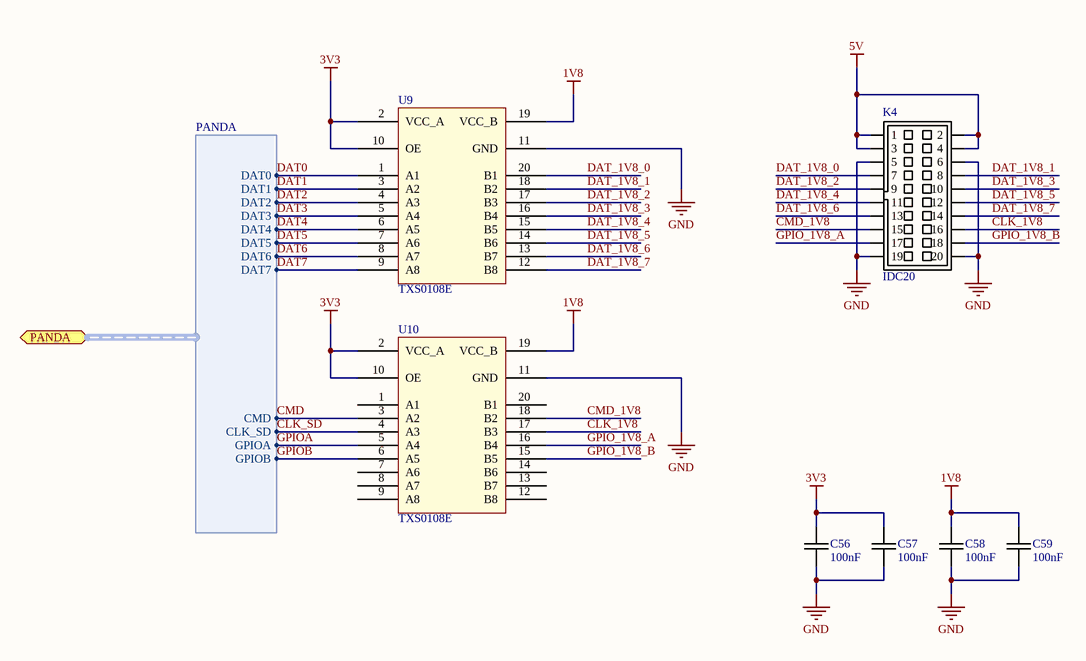
[diagram p5: panda.SchDoc]

### Parts
C56  100nF  [0603C-GENERIC]
C57  100nF  [0603C-GENERIC]
C58  100nF  [0603C-GENERIC]
C59  100nF  [0603C-GENERIC]
K4  IDC20  [IDC20-B]
U9  TXS0108E  [TSOP65P640-20BM]
U10  TXS0108E  [TSOP65P640-20BM]

### Ports
PANDA (harness PANDA)

### Harnesses
PANDA: DAT0, DAT1, DAT2, DAT3, DAT4, DAT5, DAT6, DAT7, CMD, CLK_SD, GPIOA, GPIOB

### Nets
1V8: C58.1 C59.1 U9.19(VCC_B) U10.19(VCC_B)
3V3: C56.1 C57.1 U9.2(VCC_A) U9.10(OE) U10.2(VCC_A) U10.10(OE)
5V: K4.1 K4.2 K4.3 K4.4
GND: C56.2 C57.2 C58.2 C59.2 K4.5 K4.6 K4.19 K4.20 U9.11(GND) U10.11(GND)
CLK_1V8: K4.16 U10.17(B3)
CLK_SD: U10.4(A3) ; port PANDA.CLK_SD
CMD: U10.3(A2) ; port PANDA.CMD
CMD_1V8: K4.15 U10.18(B2)
DAT0: U9.1(A1) ; port PANDA.DAT0
DAT1: U9.3(A2) ; port PANDA.DAT1
DAT2: U9.4(A3) ; port PANDA.DAT2
DAT3: U9.5(A4) ; port PANDA.DAT3
DAT4: U9.6(A5) ; port PANDA.DAT4
DAT5: U9.7(A6) ; port PANDA.DAT5
DAT6: U9.8(A7) ; port PANDA.DAT6
DAT7: U9.9(A8) ; port PANDA.DAT7
DAT_1V8_0: K4.7 U9.20(B1)
DAT_1V8_1: K4.8 U9.18(B2)
DAT_1V8_2: K4.9 U9.17(B3)
DAT_1V8_3: K4.10 U9.16(B4)
DAT_1V8_4: K4.11 U9.15(B5)
DAT_1V8_5: K4.12 U9.14(B6)
DAT_1V8_6: K4.13 U9.13(B7)
DAT_1V8_7: K4.14 U9.12(B8)
GPIO_1V8_A: K4.17 U10.16(B4)
GPIO_1V8_B: K4.18 U10.15(B5)
GPIOA: U10.5(A4) ; port PANDA.GPIOA
GPIOB: U10.6(A5) ; port PANDA.GPIOB

Not connected (* = marked no-connect by the designer): U10 1(A1) 7(A6) 8(A7) 9(A8) 12(B8) 13(B7) 14(B6) 20(B1)

### Library data of the parts
C56-C59 = 0603C-100NF-50V-X7R-TDK: as C1 on sheet fpga; RoHS: RoHS Compliant; Lead Spacing: -; Package / Case: 0603 (1608 metric); Features: General Purpose; Packaging: Tape & Reel (TR); Thickness: 0.80mm; Operating Temperature: -55°C ~ 125°C; Mounting Type: Surface Mount, MLCC; Category: Capacitors; Supplier 1: Digi-Key; Supplier Part Number 1: 445-1314-2-ND
K4 = IDC20: BOXHEADER 20 PIN; Manufacturer: Assmann Electronics Inc; Manufacturer Part Number: AWHW20G-0202-T-R; Description: CONN HEADER LOW-PRO 20POS GOLD; Number of Positions: 20; Number of Positions Loaded: All; Pitch: 0.100" (2.54mm); Connector Type: Header, Shrouded; Supplier 1: Digi-Key; Supplier Part Number 1: HRP20H-ND; Contact Type: Male Pin; Fastening Type: -; Contact Mating Length: -; Contact Finish Thickness: Flash; Number of Rows: 2; RoHS: RoHS Compliant; Category: Connectors, Interconnects; Packaging: Tray; Mounting Type: Through Hole; Contact Finish: Gold; Color: Gray; Features: -; Supplier: Digi-Key; Row Spacing: 0.100" (2.54mm); Supplier Part Number: HRP20H-ND; Termination: Solder

## Sheet camera.SchDoc
size A4
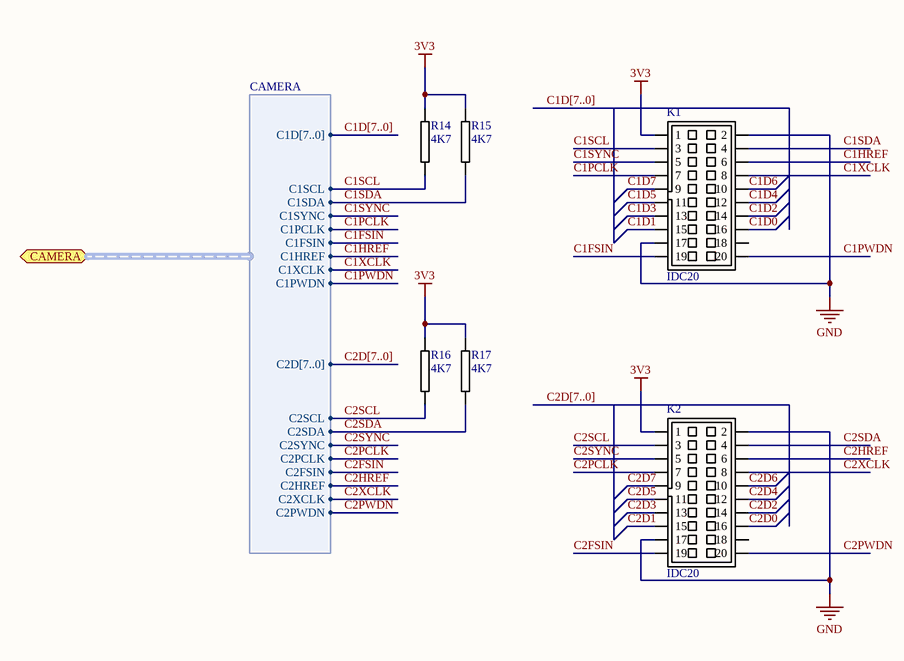
[diagram p6: camera.SchDoc]

### Parts
K1  IDC20  [HEADER20_FEMALE]
K2  IDC20  [HEADER20_FEMALE]
R14  4K7  [0603R-4K7]
R15  4K7  [0603R-4K7]
R16  4K7  [0603R-4K7]
R17  4K7  [0603R-4K7]

### Ports
CAMERA (harness CAMERA)

### Harnesses
CAMERA: C1D[7..0], C1SCL, C1SDA, C1SYNC, C1PCLK, C1FSIN, C1HREF, C1XCLK, C1PWDN, C2D[7..0], C2SCL, C2SDA, C2SYNC, C2PCLK, C2HREF, C2FSIN, C2XCLK, C2PWDN

### Nets
3V3: K1.1 K2.1 R14.1 R15.1 R16.1 R17.1
GND: K1.2 K1.17 K2.2 K2.17
C1D0: K1.16
C1D1: K1.15
C1D2: K1.14
C1D3: K1.13
C1D4: K1.12
C1D5: K1.11
C1D6: K1.10
C1D7: K1.9
C1FSIN: K1.19 ; port CAMERA.C1FSIN
C1HREF: K1.6 ; port CAMERA.C1HREF
C1PCLK: K1.7 ; port CAMERA.C1PCLK
C1PWDN: K1.20 ; port CAMERA.C1PWDN
C1SCL: K1.3 R14.2 ; port CAMERA.C1SCL
C1SDA: K1.4 R15.2 ; port CAMERA.C1SDA
C1SYNC: K1.5 ; port CAMERA.C1SYNC
C1XCLK: K1.8 ; port CAMERA.C1XCLK
C2D0: K2.16
C2D1: K2.15
C2D2: K2.14
C2D3: K2.13
C2D4: K2.12
C2D5: K2.11
C2D6: K2.10
C2D7: K2.9
C2FSIN: K2.19 ; port CAMERA.C2FSIN
C2HREF: K2.6 ; port CAMERA.C2HREF
C2PCLK: K2.7 ; port CAMERA.C2PCLK
C2PWDN: K2.20 ; port CAMERA.C2PWDN
C2SCL: K2.3 R16.2 ; port CAMERA.C2SCL
C2SDA: K2.4 R17.2 ; port CAMERA.C2SDA
C2SYNC: K2.5 ; port CAMERA.C2SYNC
C2XCLK: K2.8 ; port CAMERA.C2XCLK

Not connected (* = marked no-connect by the designer): K1 18; K2 18

### Buses and harness runs
bus C1D[7..0]
bus C2D[7..0]

### Library data of the parts
K1 K2 = IDC20: as K4 on sheet panda; Supplier 1: Digi-Key; Supplier Part Number 1: HRP20H-ND; Contact Type: Male Pin; Fastening Type: -; Contact Mating Length: -; Contact Finish Thickness: Flash; Number of Rows: 2; RoHS: RoHS Compliant; Category: Connectors, Interconnects; Packaging: Tray; Mounting Type: Through Hole; Contact Finish: Gold; Color: Gray; Features: -; Supplier: Digi-Key; Row Spacing: 0.100" (2.54mm); Supplier Part Number: HRP20H-ND; Termination: Solder
R14-R17 = 0603R-4K7: as R1 on sheet fpga; Supplier 1: Digi-Key; Supplier Part Number 1: RMCF1/164.7KFRTR-ND

## Sheet sdram.SchDoc
size A4
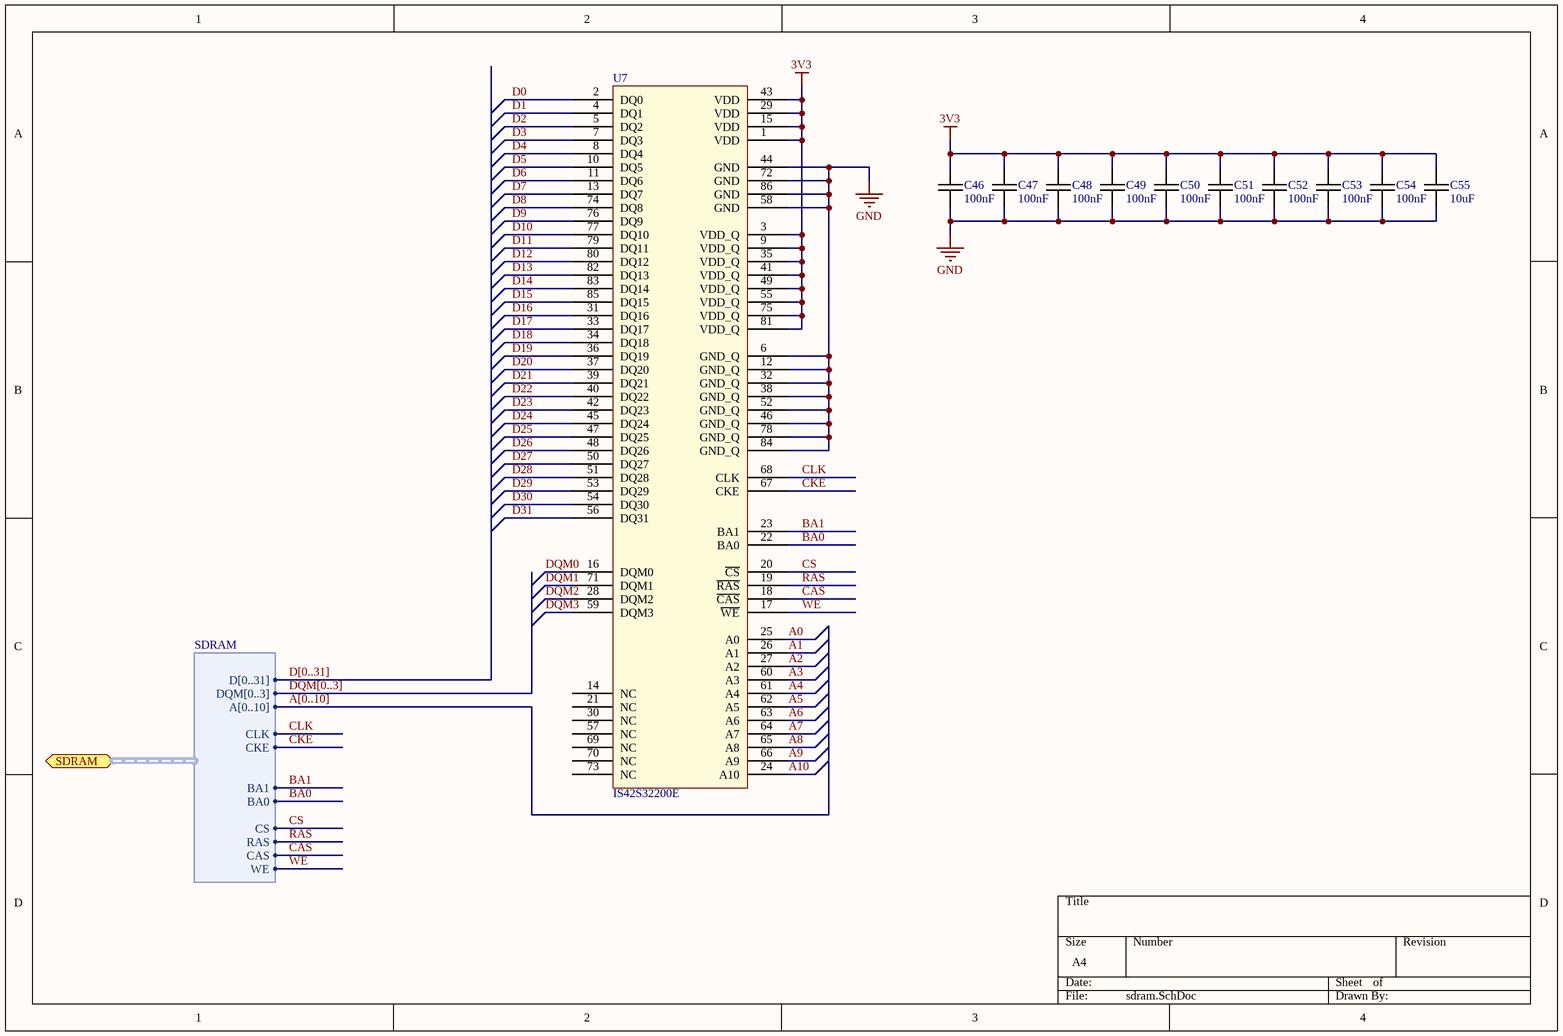
[diagram p7: sdram.SchDoc]

### Parts
C46  100nF  [0603C-GENERIC]
C47  100nF  [0603C-GENERIC]
C48  100nF  [0603C-GENERIC]
C49  100nF  [0603C-GENERIC]
C50  100nF  [0603C-GENERIC]
C51  100nF  [0603C-GENERIC]
C52  100nF  [0603C-GENERIC]
C53  100nF  [0603C-GENERIC]
C54  100nF  [0603C-GENERIC]
C55  10uF  [0805C-GENERIC]
U7  IS42S32200E  [TSSOP50P1175-86M]

### Ports
SDRAM (harness SDRAM)

### Harnesses
SDRAM: D[0..31], DQM[0..3], A[0..10], CLK, CKE, BA1, BA0, CS, RAS, CAS, WE

### Nets
3V3: C46.1 C47.1 C48.1 C49.1 C50.1 C51.1 C52.1 C53.1 C54.1 C55.1 U7.1(VDD) U7.3(VDD_Q) U7.9(VDD_Q) U7.15(VDD) U7.29(VDD) U7.35(VDD_Q) U7.41(VDD_Q) U7.43(VDD) U7.49(VDD_Q) U7.55(VDD_Q) U7.75(VDD_Q) U7.81(VDD_Q)
GND: C46.2 C47.2 C48.2 C49.2 C50.2 C51.2 C52.2 C53.2 C54.2 C55.2 U7.6(GND_Q) U7.12(GND_Q) U7.32(GND_Q) U7.38(GND_Q) U7.44(GND) U7.46(GND_Q) U7.52(GND_Q) U7.58(GND) U7.72(GND) U7.78(GND_Q) U7.84(GND_Q) U7.86(GND)
A0: U7.25(A0)
A1: U7.26(A1)
A2: U7.27(A2)
A3: U7.60(A3)
A4: U7.61(A4)
A5: U7.62(A5)
A6: U7.63(A6)
A7: U7.64(A7)
A8: U7.65(A8)
A9: U7.66(A9)
A10: U7.24(A10)
BA0: U7.22(BA0) ; port SDRAM.BA0
BA1: U7.23(BA1) ; port SDRAM.BA1
CAS: U7.18(~{CAS}) ; port SDRAM.CAS
CKE: U7.67(CKE) ; port SDRAM.CKE
CLK: U7.68(CLK) ; port SDRAM.CLK
CS: U7.20(~{CS}) ; port SDRAM.CS
D0: U7.2(DQ0)
D1: U7.4(DQ1)
D2: U7.5(DQ2)
D3: U7.7(DQ3)
D4: U7.8(DQ4)
D5: U7.10(DQ5)
D6: U7.11(DQ6)
D7: U7.13(DQ7)
D8: U7.74(DQ8)
D9: U7.76(DQ9)
D10: U7.77(DQ10)
D11: U7.79(DQ11)
D12: U7.80(DQ12)
D13: U7.82(DQ13)
D14: U7.83(DQ14)
D15: U7.85(DQ15)
D16: U7.31(DQ16)
D17: U7.33(DQ17)
D18: U7.34(DQ18)
D19: U7.36(DQ19)
D20: U7.37(DQ20)
D21: U7.39(DQ21)
D22: U7.40(DQ22)
D23: U7.42(DQ23)
D24: U7.45(DQ24)
D25: U7.47(DQ25)
D26: U7.48(DQ26)
D27: U7.50(DQ27)
D28: U7.51(DQ28)
D29: U7.53(DQ29)
D30: U7.54(DQ30)
D31: U7.56(DQ31)
DQM0: U7.16(DQM0)
DQM1: U7.71(DQM1)
DQM2: U7.28(DQM2)
DQM3: U7.59(DQM3)
RAS: U7.19(~{RAS}) ; port SDRAM.RAS
WE: U7.17(~{WE}) ; port SDRAM.WE

Not connected (* = marked no-connect by the designer): U7 14(NC) 21(NC) 30(NC) 57(NC) 69(NC) 70(NC) 73(NC)

### Buses and harness runs
bus A[0..10]
bus D[0..31]
bus DQM[0..3]

### Library data of the parts
C46-C54 = 0603C-100NF-50V-X7R-TDK: as C1 on sheet fpga; RoHS: RoHS Compliant; Lead Spacing: -; Package / Case: 0603 (1608 metric); Features: General Purpose; Packaging: Tape & Reel (TR); Thickness: 0.80mm; Operating Temperature: -55°C ~ 125°C; Mounting Type: Surface Mount, MLCC; Category: Capacitors; Supplier 1: Digi-Key; Supplier Part Number 1: 445-1314-2-ND
C55 = 0805C-10UF-16V-X5R-TDK: as C7 on sheet fpga; Supplier 1: Digi-Key; Supplier Part Number 1: 445-4115-2-ND

## Nets that join several sheets
1V2: fpga (9 pins), power (C36.1 L3.2 U4.10)
1V8: power (C37.1 L4.2 U5.10), panda (C58.1 C59.1 U9.19 U10.19)
2V5: fpga (19 pins), power (C31.1 L2.2 U3.10), config (C43.1 U6.20)
3V3: fpga (28 pins), power (C30.1 L1.2 R25.1 U2.10), config (8 pins), panda (6 pins), camera (6 pins), sdram (22 pins)
5V: power (16 pins), panda (K4.1 K4.2 K4.3 K4.4)
GND: fpga (55 pins), power (39 pins), config (9 pins), panda (10 pins), camera (K1.2 K1.17 K2.2 K2.17), sdram (22 pins)
A0: fpga (RP2.1), sdram (U7.25)
A1: fpga (RP2.2), sdram (U7.26)
A2: fpga (RP2.3), sdram (U7.27)
A3: fpga (RP2.6), sdram (U7.60)
A4: fpga (RP2.7), sdram (U7.61)
A5: fpga (RP2.8), sdram (U7.62)
A6: fpga (RP3.1), sdram (U7.63)
A7: fpga (RP3.2), sdram (U7.64)
A8: fpga (RP3.3), sdram (U7.65)
A9: fpga (RP3.4), sdram (U7.66)
A10: fpga (RP6.8), sdram (U7.24)
BA0: fpga (RP6.6), sdram (U7.22)
BA1: fpga (RP6.7), sdram (U7.23)
C1D0: fpga (U1.24), camera (K1.16)
C1D1: fpga (U1.23), camera (K1.15)
C1D2: fpga (U1.22), camera (K1.14)
C1D3: fpga (U1.19), camera (K1.13)
C1D4: fpga (U1.18), camera (K1.12)
C1D5: fpga (U1.16), camera (K1.11)
C1D6: fpga (U1.15), camera (K1.10)
C1D7: fpga (U1.12), camera (K1.9)
C1FSIN: fpga (U1.28), camera (K1.19)
C1HREF: fpga (U1.8), camera (K1.6)
C1PCLK: fpga (U1.9), camera (K1.7)
C1PWDN: fpga (U1.25), camera (K1.20)
C1SCL: fpga (U1.3), camera (K1.3 R14.2)
C1SDA: fpga (U1.4), camera (K1.4 R15.2)
C1SYNC: fpga (U1.5), camera (K1.5)
C1XCLK: fpga (U1.11), camera (K1.8)
C2D0: fpga (U1.48), camera (K2.16)
C2D1: fpga (U1.47), camera (K2.15)
C2D2: fpga (U1.45), camera (K2.14)
C2D3: fpga (U1.42), camera (K2.13)
C2D4: fpga (U1.41), camera (K2.12)
C2D5: fpga (U1.40), camera (K2.11)
C2D6: fpga (U1.39), camera (K2.10)
C2D7: fpga (U1.36), camera (K2.9)
C2FSIN: fpga (U1.49), camera (K2.19)
C2HREF: fpga (U1.33), camera (K2.6)
C2PCLK: fpga (U1.29), camera (K2.7)
C2PWDN: fpga (U1.50), camera (K2.20)
C2SCL: fpga (U1.34), camera (K2.3 R16.2)
C2SDA: fpga (U1.35), camera (K2.4 R17.2)
C2SYNC: fpga (U1.31), camera (K2.5)
C2XCLK: fpga (U1.30), camera (K2.8)
CAS: fpga (RP6.3), sdram (U7.18)
CKE: fpga (RP3.6), sdram (U7.67)
CLK: fpga (RP3.7), sdram (U7.68)
CLK_SD: fpga (U1.180), panda (U10.4)
CMD: fpga (U1.181), panda (U10.3)
CS: fpga (RP6.5), sdram (U7.20)
D0: fpga (RP4.8), sdram (U7.2)
D1: fpga (RP4.7), sdram (U7.4)
D2: fpga (RP4.6), sdram (U7.5)
D3: fpga (RP4.5), sdram (U7.7)
D4: fpga (RP4.4), sdram (U7.8)
D5: fpga (RP4.3), sdram (U7.10)
D6: fpga (RP4.2), sdram (U7.11)
D7: fpga (RP4.1), sdram (U7.13)
D8: fpga (RP5.8), sdram (U7.74)
D9: fpga (RP5.7), sdram (U7.76)
D10: fpga (RP5.6), sdram (U7.77)
D11: fpga (RP5.5), sdram (U7.79)
D12: fpga (RP5.4), sdram (U7.80)
D13: fpga (RP5.3), sdram (U7.82)
D14: fpga (RP5.2), sdram (U7.83)
D15: fpga (RP5.1), sdram (U7.85)
D16: fpga (RP1.8), sdram (U7.31)
D17: fpga (RP1.7), sdram (U7.33)
D18: fpga (RP1.6), sdram (U7.34)
D19: fpga (RP1.5), sdram (U7.36)
D20: fpga (RP1.4), sdram (U7.37)
D21: fpga (RP1.3), sdram (U7.39)
D22: fpga (RP1.2), sdram (U7.40)
D23: fpga (RP1.1), sdram (U7.42)
D24: fpga (RP7.8), sdram (U7.45)
D25: fpga (RP7.7), sdram (U7.47)
D26: fpga (RP7.6), sdram (U7.48)
D27: fpga (RP7.5), sdram (U7.50)
D28: fpga (RP7.4), sdram (U7.51)
D29: fpga (RP7.3), sdram (U7.53)
D30: fpga (RP7.2), sdram (U7.54)
D31: fpga (RP7.1), sdram (U7.56)
DAT0: fpga (U1.200), panda (U9.1)
DAT1: fpga (U1.199), panda (U9.3)
DAT2: fpga (U1.197), panda (U9.4)
DAT3: fpga (U1.196), panda (U9.5)
DAT4: fpga (U1.193), panda (U9.6)
DAT5: fpga (U1.192), panda (U9.7)
DAT6: fpga (U1.190), panda (U9.8)
DAT7: fpga (U1.189), panda (U9.9)
DONE: fpga (R2.2 U1.104), config (R26.1 U6.10)
DQM0: fpga (RP6.1), sdram (U7.16)
DQM1: fpga (RP3.8), sdram (U7.71)
DQM2: fpga (RP2.4), sdram (U7.28)
DQM3: fpga (RP2.5), sdram (U7.59)
GPIOA: fpga (U1.179), panda (U10.5)
GPIOB: fpga (U1.178), panda (U10.6)
MAIN_OSC: fpga (U1.80), config (U8.3)
PF_CLK: fpga (U1.103), config (C45.1 R13.1)
PF_DIN: fpga (U1.87), config (R12.2)
PF_INIT: fpga (U1.56), config (R10.2 U6.8)
PROG: fpga (R1.2 U1.1), config (U6.7)
RAS: fpga (RP6.4), sdram (U7.19)
TCK: fpga (U1.158), config (R7.1 U6.6)
TDI: fpga (U1.207), config (R8.1)
TDO_FPGA: fpga (U1.157), config (U6.4)
TMS: fpga (U1.155), config (R9.1 U6.5)
WE: fpga (RP6.2), sdram (U7.17)